# EAGLE design daGloane1.1 (EAGLE 6.1)
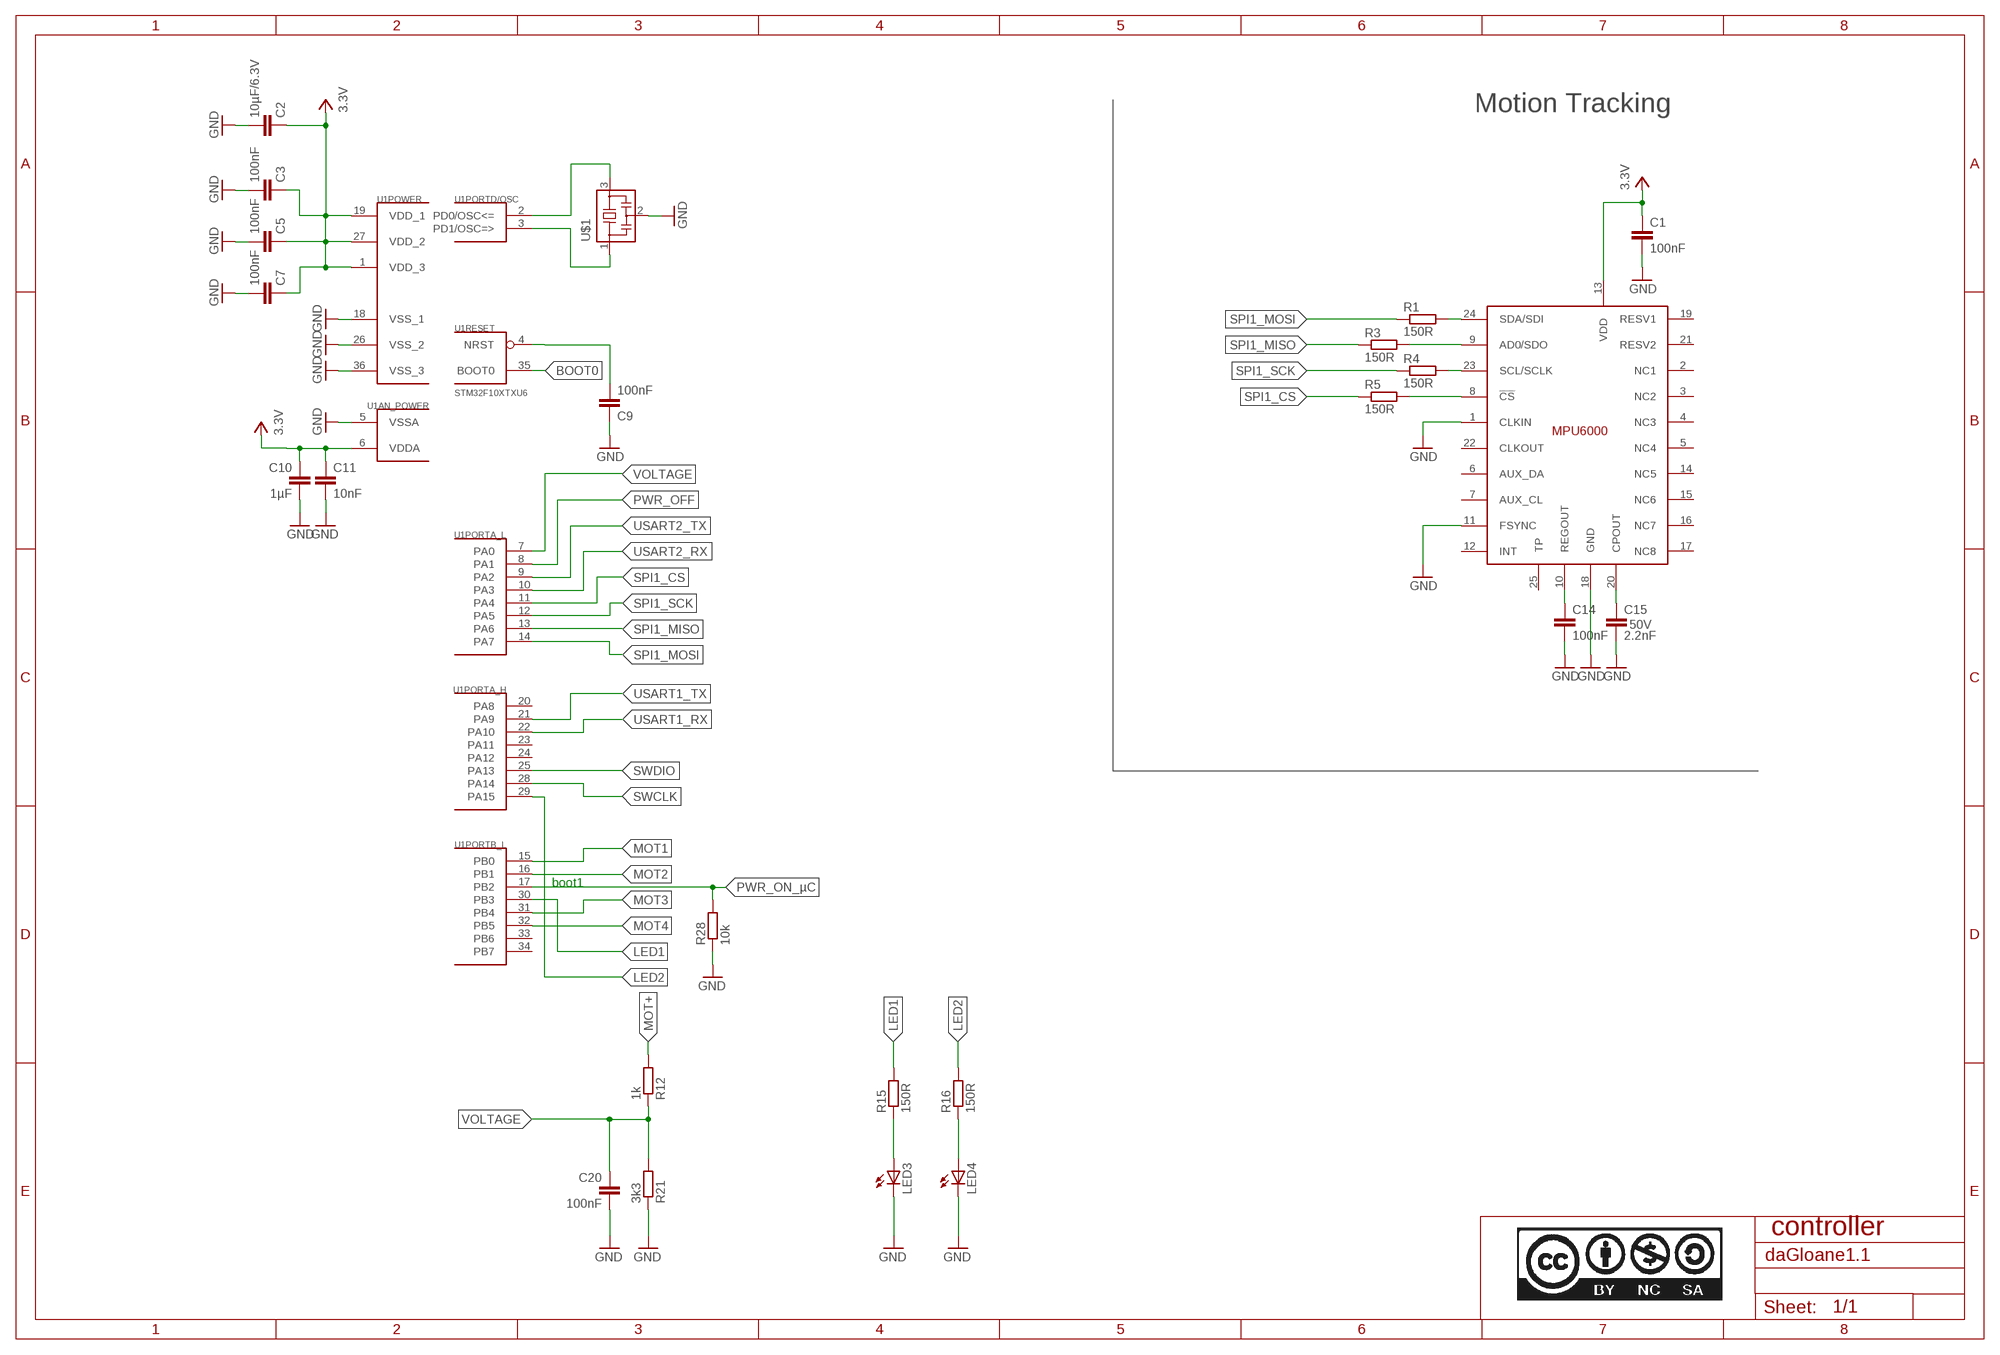
[diagram p0: schematic, sheet 1, part 1 of 3]
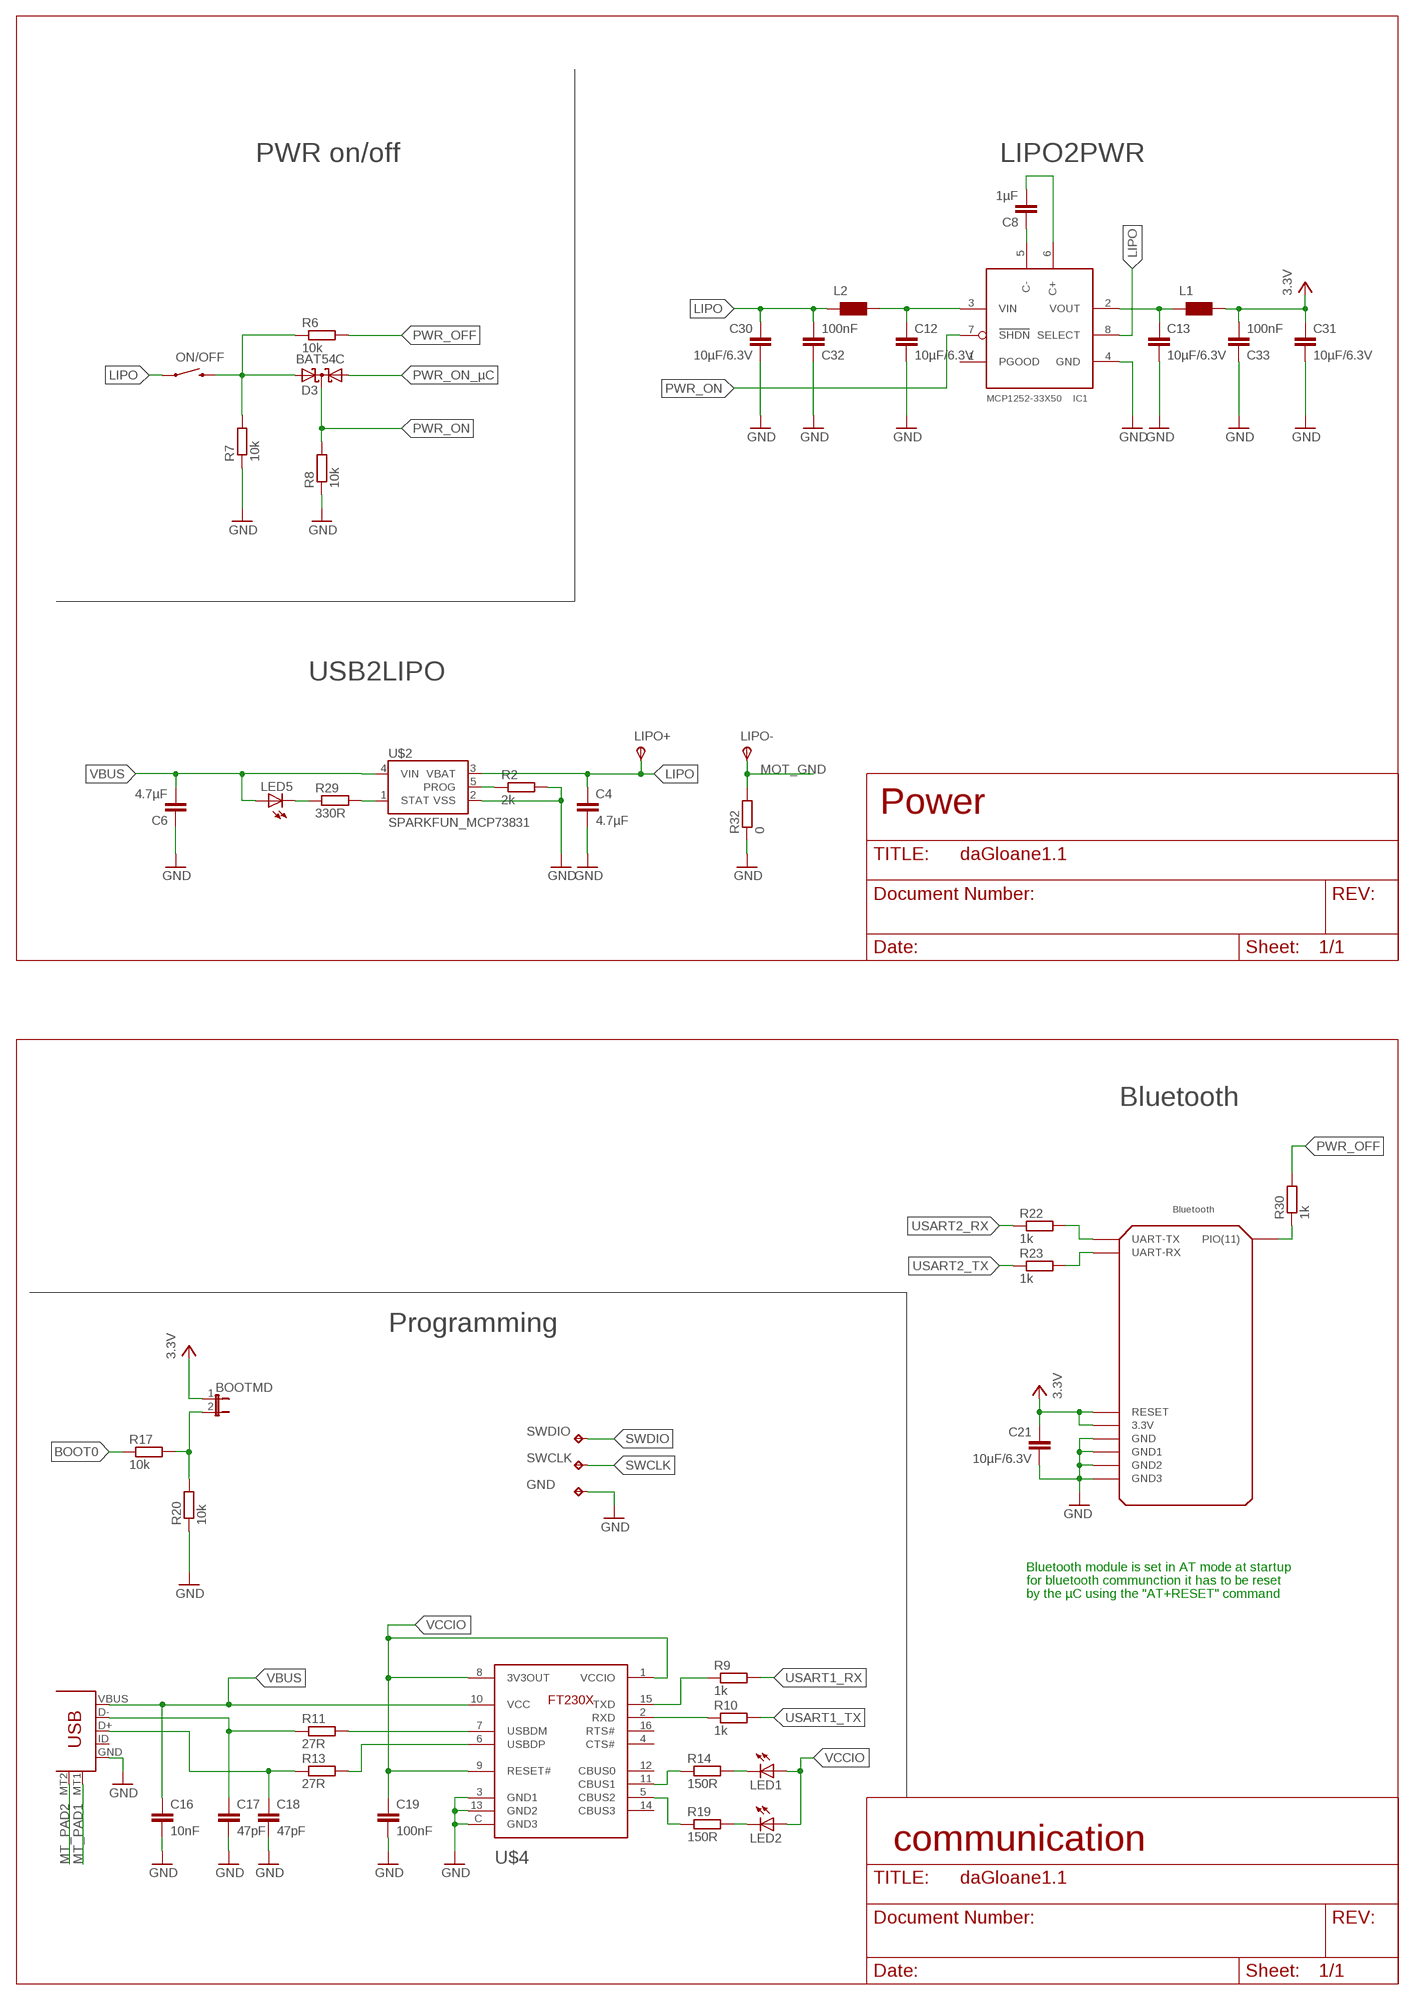
[diagram p1: schematic, sheet 1, part 2 of 3]
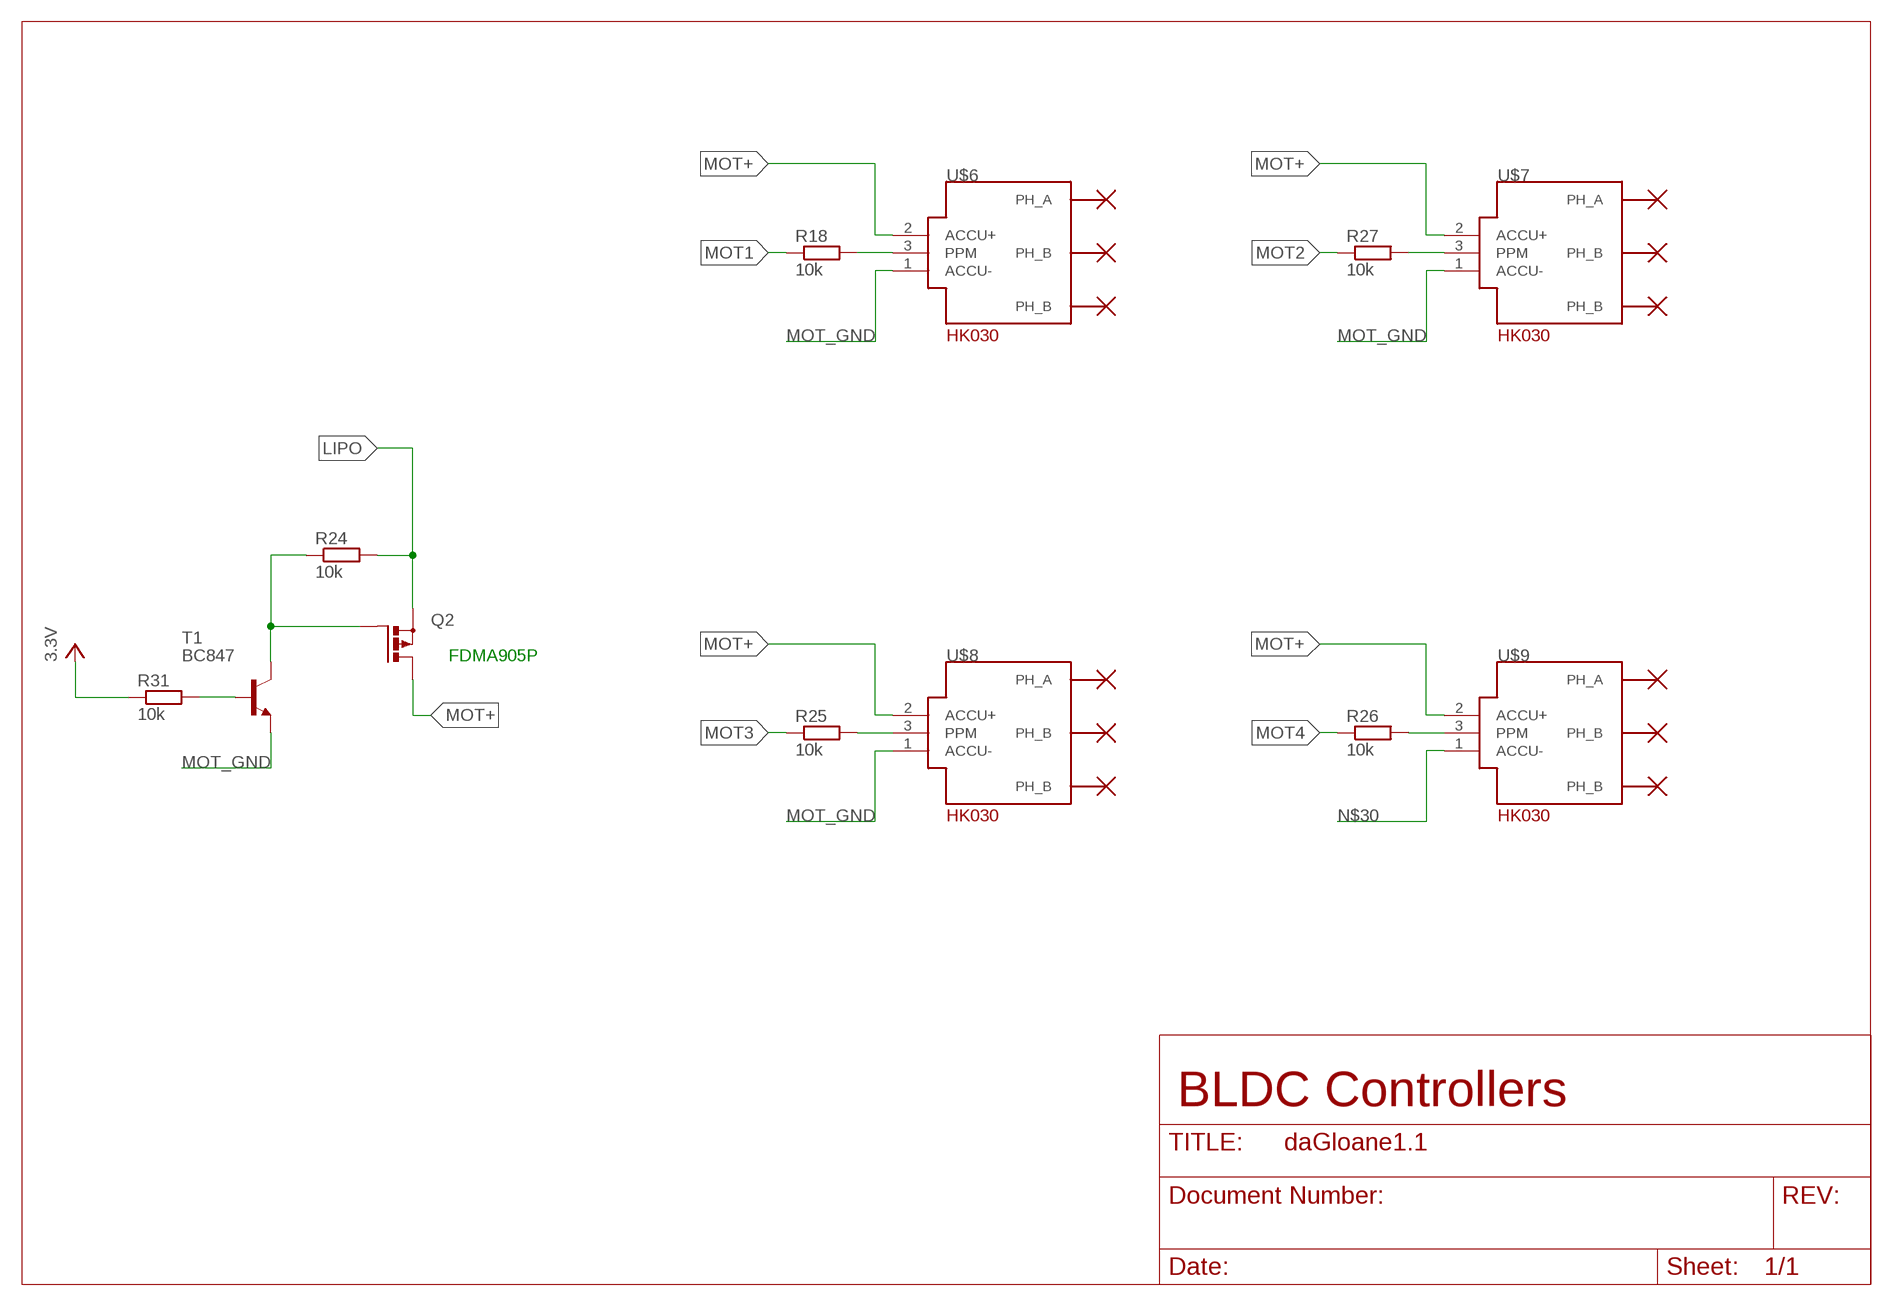
[diagram p2: schematic, sheet 1, part 3 of 3]

## Parts
BOOTMD  JUMPER-2  [1X02_50MIL]
C1  100nF  C-EUC0603  [C0603]
C2  10µF/6.3V  C-EUC0805  [C0805]
C3  100nF  C-EUC0603  [C0603]
C4  4.7µF  C-EUC0603  [C0603]
C5  100nF  C-EUC0603  [C0603]
C6  4.7µF  C-EUC0603  [C0603]
C7  100nF  C-EUC0603  [C0603]
C8  1µF  C-EUC0603  [C0603]
C9  100nF  C-EUC0603  [C0603]
C10  1µF  C-EUC0603  [C0603]
C11  10nF  C-EUC0603  [C0603]
C12  10µF/6.3V  C-EUC0805  [C0805]
C13  10µF/6.3V  C-EUC0805  [C0805]
C14  100nF  C-EUC0603  [C0603]
C15  2.2nF  C-EUC0603  [C0603]
C16  10nF  C-EUC0603  [C0603]
C17  47pF  C-EUC0603  [C0603]
C18  47pF  C-EUC0603  [C0603]
C19  100nF  C-EUC0603  [C0603]
C20  100nF  C-EUC0603  [C0603]
C21  10µF/6.3V  C-EUC0805  [C0805]
C30  10µF/6.3V  C-EUC0805  [C0805]
C31  10µF/6.3V  C-EUC0805  [C0805]
C32  100nF  C-EUC0603  [C0603]
C33  100nF  C-EUC0603  [C0603]
D3  BAT54C  [SOT23]
GND  TESTPAD_TPB1,27  [TESTPAD_B1,27]
IC1  MCP1252-33X50  [MSOP8]
L1  WUERTH-ELEKTRONIK_WE-KI_0805_B  [WUERTH-ELEKTRONIK_WE-KI_0805_B]
L2  WUERTH-ELEKTRONIK_WE-KI_0805_B  [WUERTH-ELEKTRONIK_WE-KI_0805_B]
LED1  LEDCHIPLED_0603  [CHIPLED_0603]
LED2  LEDCHIPLED_0603  [CHIPLED_0603]
LED3  LEDCHIPLED_0603  [CHIPLED_0603]
LED4  LEDCHIPLED_0603  [CHIPLED_0603]
LED5  LEDCHIPLED_0603  [CHIPLED_0603]
LIPO+  TPSPAD1-13  [P1-13]
LIPO-  TPSPAD1-13  [P1-13]
ON/OFF  SWITCH-MOMENTARY-2SMD  [TACTILE_SWITCH_SMD]
Q2  P-MOSFET-SO8  [MICROFET2X2]
R1  150R  R-EU_R0603  [R0603]
R2  2k  R-EU_R0603  [R0603]
R3  150R  R-EU_R0603  [R0603]
R4  150R  R-EU_R0603  [R0603]
R5  150R  R-EU_R0603  [R0603]
R6  10k  R-EU_R0603  [R0603]
R7  10k  R-EU_R0603  [R0603]
R8  10k  R-EU_R0603  [R0603]
R9  1k  R-EU_R0603  [R0603]
R10  1k  R-EU_R0603  [R0603]
R11  27R  R-EU_R0603  [R0603]
R12  1k  R-EU_R0603  [R0603]
R13  27R  R-EU_R0603  [R0603]
R14  150R  R-EU_R0603  [R0603]
R15  150R  R-EU_R0603  [R0603]
R16  150R  R-EU_R0603  [R0603]
R17  10k  R-EU_R0603  [R0603]
R18  10k  R-EU_R0603  [R0603]
R19  150R  R-EU_R0603  [R0603]
R20  10k  R-EU_R0603  [R0603]
R21  3k3  R-EU_R0603  [R0603]
R22  1k  R-EU_R0603  [R0603]
R23  1k  R-EU_R0603  [R0603]
R24  10k  R-EU_R0603  [R0603]
R25  10k  R-EU_R0603  [R0603]
R26  10k  R-EU_R0603  [R0603]
R27  10k  R-EU_R0603  [R0603]
R28  10k  R-EU_R0603  [R0603]
R29  330R  R-EU_R0603  [R0603]
R30  1k  R-EU_R0603  [R0603]
R31  10k  R-EU_R0603  [R0603]
R32  0  R-EU_R0603  [R0603]
SWCLK  TESTPAD_TPB1,27  [TESTPAD_B1,27]
SWDIO  TESTPAD_TPB1,27  [TESTPAD_B1,27]
T1  BC847  [SOT23]
U1  STM32F10XTXU6  [VFQFPN36]
U$1  MURATA-FILTER_CSTCE__G  [MURATA-FILTER_CSTCE__G]
U$2  SPARKFUN_MCP73831  [SPARKFUN_SOT23-5]
U$3  MPU6000  [MPU6000]
U$4  SERIAL_FT230XQ  [SERIAL_QFN4X4-16]
U$5  BLUETOOTH_REDUCED  [BLUETOOTH_REDUCED]
U$6  3A_BLDC_CONTROLLER  [3A_BLDC_CONTROLLER]
U$7  3A_BLDC_CONTROLLER  [3A_BLDC_CONTROLLER]
U$8  3A_BLDC_CONTROLLER  [3A_BLDC_CONTROLLER]
U$9  3A_BLDC_CONTROLLER  [3A_BLDC_CONTROLLER]
X2  USB_MICROB_PLUG_MT  [SPARKFUN-CONNECTORS_USB-MICROB]

## Nets
BOOT0: R17.1 U1.35(RESET:BOOT0)
D+: C18.1 R13.1 X2.D+
D-: C17.1 R11.1 X2.D-
GND: C1.2 C2.2 C3.2 C4.2 C5.2 C6.1 C7.2 C9.1 C10.2 C11.2 C12.2 C13.2 C14.2 C15.2 C16.2 C17.2 C18.2 C19.2 C20.2 C21.2 C30.2 C31.2 C32.1 C33.1 GND.PP(TP) IC1.4(GND) LED3.C LED4.C R2.2 R7.1 R8.1 R20.1 R21.1 R28.1 R32.1 U1.5(AN_POWER:VSSA) U1.18(POWER:VSS_1) U1.26(POWER:VSS_2) U1.36(POWER:VSS_3) U$1.2 U$2.2(VSS) U$3.1(CLKIN) U$3.11(FSYNC) U$3.18(GND) U$4.3(GND1) U$4.13(GND2) U$4.C(GND3) U$5.P$13(GND) U$5.P$14(GND1) U$5.P$21(GND2) U$5.P$22(GND3) X2.GND
LED1: R15.2 U1.30(PORTB_L:PB3)
LED2: R16.2 U1.29(PORTA_H:PA15)
LIPO: C4.1 C30.1 C32.2 IC1.8(SELECT) L2.2 LIPO+.TP(PP) ON/OFF.1 Q2.P$4(S) Q2.P$7(S) R24.2 U$2.3(VBAT)
MOT1: R18.1 U1.15(PORTB_L:PB0)
MOT2: R27.1 U1.16(PORTB_L:PB1)
MOT3: R25.1 U1.31(PORTB_L:PB4)
MOT4: R26.1 U1.32(PORTB_L:PB5)
MOT+: Q2.P$1(D) Q2.P$2(D) Q2.P$5(D) Q2.P$6(D) Q2.P$8(D) R12.2 U$6.2(ACCU+) U$7.2(ACCU+) U$8.2(ACCU+) U$9.2(ACCU+)
MOT_GND: LIPO-.TP(PP) R32.2 T1.2(E) U$6.1(ACCU-) U$7.1(ACCU-) U$8.1(ACCU-)
MT_PAD1: X2.MT1(MTN1)
MT_PAD2: X2.MT2(MTN2)
N$1: LED2.C R19.2
N$2: U1.2(PORTD/OSC:PD0/OSC<=) U$1.3
N$3: R2.1 U$2.5(PROG)
N$4: R5.2 U$3.8(!CS)
N$5: C15.1 U$3.20(CPOUT)
N$6: C14.1 U$3.10(REGOUT)
N$7: R22.2 U$5.P$1(UART-TX)
N$8: LED3.A R15.1
N$9: LED4.A R16.1
N$10: BOOTMD.2 R17.2 R20.2
N$11: R14.1 U$4.11(CBUS1)
N$12: R19.1 U$4.5(CBUS2)
N$13: R4.2 U$3.23(SCL/SCLK)
N$14: LED1.C R14.2
N$15: R23.2 U$5.P$2(UART-RX)
N$16: R11.2 U$4.7(USBDM)
N$17: R13.2 U$4.6(USBDP)
N$18: R3.2 U$3.9(AD0/SDO)
N$19: R1.2 U$3.24(SDA/SDI)
N$20: R9.1 U$4.15(TXD)
N$21: R10.1 U$4.2(RXD)
N$22: R18.2 U$6.3(PPM)
N$23: D3.2(A2) ON/OFF.3 R6.1 R7.2
N$24: C8.2 IC1.6(C+)
N$25: U1.3(PORTD/OSC:PD1/OSC=>) U$1.1
N$26: R30.1 U$5.P$34(PIO(11))
N$27: Q2.P$3(G) R24.1 T1.3(C)
N$28: C8.1 IC1.5(C-)
N$29: R31.2 T1.1(B)
N$30: U$9.1(ACCU-)
N$39: R27.2 U$7.3(PPM)
N$40: R25.2 U$8.3(PPM)
N$41: R26.2 U$9.3(PPM)
N$43: R29.2 U$2.1(STAT)
N$44: LED5.C R29.1
N$45: C12.1 IC1.3(VIN) L2.1
N$46: C13.1 IC1.2(VOUT) L1.2
PWR_OFF: R6.2 R30.2 U1.8(PORTA_L:PA1)
PWR_ON: D3.3(CC) IC1.7(SHDN) R8.2
PWR_ON_µC: D3.1(A1) R28.2 U1.17(PORTB_L:PB2)
RESET1: C9.2 U1.4(RESET:NRST)
SPI1_CS: R5.1 U1.11(PORTA_L:PA4)
SPI1_MISO: R3.1 U1.13(PORTA_L:PA6)
SPI1_MOSI: R1.1 U1.14(PORTA_L:PA7)
SPI1_SCK: R4.1 U1.12(PORTA_L:PA5)
SWCLK: SWCLK.PP(TP) U1.28(PORTA_H:PA14)
SWDIO: SWDIO.PP(TP) U1.25(PORTA_H:PA13)
USART1_RX: R9.2 U1.22(PORTA_H:PA10)
USART1_TX: R10.2 U1.21(PORTA_H:PA9)
USART2_RX: R22.1 U1.10(PORTA_L:PA3)
USART2_TX: R23.1 U1.9(PORTA_L:PA2)
VBUS: C6.2 C16.1 LED5.A U$2.4(VIN) U$4.10(VCC) X2.VBUS
VCC: BOOTMD.1 C1.1 C2.1 C3.1 C5.1 C7.1 C10.1 C11.1 C21.1 C31.1 C33.2 L1.1 R31.1 U1.1(POWER:VDD_3) U1.6(AN_POWER:VDDA) U1.19(POWER:VDD_1) U1.27(POWER:VDD_2) U$3.13(VDD) U$5.P$11(RESET) U$5.P$12(3.3V) ; supply symbol labelled 3.3V
VCCIO: C19.1 LED1.A LED2.A U$4.1(VCCIO) U$4.8(3V3OUT) U$4.9(RESET#)
VOLTAGE: C20.1 R12.1 R21.2 U1.7(PORTA_L:PA0)
Unconnected: IC1.1(PGOOD) U1.20(PORTA_H:PA8) U1.23(PORTA_H:PA11) U1.24(PORTA_H:PA12) U1.33(PORTB_L:PB6) U1.34(PORTB_L:PB7) U$3.2(NC1) U$3.3(NC2) U$3.4(NC3) U$3.5(NC4) U$3.6(AUX_DA) U$3.7(AUX_CL) U$3.12(INT) U$3.14(NC5) U$3.15(NC6) U$3.16(NC7) U$3.17(NC8) U$3.19(RESV1) U$3.21(RESV2) U$3.22(CLKOUT) U$3.25(TP) U$4.4(CTS#) U$4.12(CBUS0) U$4.14(CBUS3) U$4.16(RTS#) X2.ID

## Notes on the sheet
- Motion Tracking
- boot1
- controller
- PWR on/off | LIPO2PWR
- FDMA905P
- USB2LIPO
- Power
- BLDC Controllers
- Bluetooth
- Programming
- Bluetooth module is set in AT mode at startup
- for bluetooth communction it has to be reset
- by the µC using the "AT+RESET" command
- FT230X
- communication

## Library data of the parts
BOOTMD = daGloane:JUMPER-2: Jumper Basic 0.1" spaced jumper. Use with breakaway headers.
C1-C14 C16-C21 C30-C33 = rcl:C-EU: CAPACITOR, European symbol
C15 = rcl:C-EU: CAPACITOR, European symbol; VOLTAGE: 50V
D3 = diode:BAT54C: Schottky Diodes Source: Fairchild .. BAT54.pdf
GND SWCLK SWDIO = daGloane:TESTPAD_TP: Test pad
IC1 = daGloane:MCP1252-33X50: 650KHz 3.3V / 5.0V Selectable Switching Regulator
L1 L2 = daGloane:WUERTH-ELEKTRONIK_WE-KI: SMD Wire Wound Ceramic Inductor WE-KI - Wire wound - High thermal stability - Rated current up to 1 A - High Q-factor - High SRF -- Especially developed for high frequency applications -- Perfect for applications in telecommunications -- Bluetooth -- Wireless LAN
LED1-LED5 = led:LED: LED OSRAM: - CHIPLED LG R971, LG N971, LY N971, LG Q971, LY Q971, LO R971, LY R971 LH N974, LH R974 LS Q976, LO Q976, LY Q976 LO Q996 - Hyper CHIPLED LW Q18S LB Q993, LB Q99A, LB R99A - SideLED LS A670, LO A670, LY A670, LG A670, LP A670 LB A673, LV A673, LT A673, LW A673 LH A674 LY A675 LS A676, LA A676, LO A676, LY A676, LW A676 LS A679, LY A679, LG A679 - Hyper Micro SIDELED® LS Y876, LA Y876, LO Y876, LY Y876 LT Y87S - SmartLED LW L88C, LW L88S LB L89C, LB L89S, LG L890 LS L89K, LO L89K, LY L89K LS L896, LA L896, LO L896, LY L896 - TOPLED LS T670, LO T670, LY T670, LG T670, LP T670 LSG T670, LSP T670, LSY T670, LOP T670, LYG T670 LG T671, LOG T671, LSG T671 LB T673, LV T673, LT T673, LW T673 LH T674 LS T676, LA T676, LO T676, LY T676, LB T676, LH T676, LSB T676, LW T676 LB T67C, LV T67C, LT T67C, LS T67K, LO T67K, LY T67K, LW E67C LS E67B, LA E67B, LO E67B, LY E67B, LB E67C, LV E67C, LT E67C LW T67C LS T679, LY T679, LG T679 LS T770, LO T770, LY T770, LG T770, LP T770 LB T773, LV T773, LT T773, LW T773 LH T774 LS E675, LA E675, LY E675, LS T675 LS T776, LA T776, LO T776, LY T776, LB T776 LHGB T686 LT T68C, LB T68C - Hyper Mini TOPLED® LB M676 - Mini TOPLED Santana® LG M470 LS M47K, LO M47K, LY M47K Source: http://www.osram.convergy.de LUXEON: - LUMILED® LXK2-PW12-R00, LXK2-PW12-S00, LXK2-PW14-U00, LXK2-PW14-V00 LXK2-PM12-R00, LXK2-PM12-S00, LXK2-PM14-U00 LXK2-PE12-Q00, LXK2-PE12-R00, LXK2-PE12-S00, LXK2-PE14-T00, LXK2-PE14-U00 LXK2-PB12-K00, LXK2-PB12-L00, LXK2-PB12-M00, LXK2-PB14-N00, LXK2-PB14-P00, LXK2-PB14-Q00 LXK2-PR12-L00, LXK2-PR12-M00, LXK2-PR14-Q00, LXK2-PR14-R00 LXK2-PD12-Q00, LXK2-PD12-R00, LXK2-PD12-S00 LXK2-PH12-R00, LXK2-PH12-S00 LXK2-PL12-P00, LXK2-PL12-Q00, LXK2-PL12-R00 Source: www.luxeon.com KINGBRIGHT: KA-3528ASYC Source: www.kingbright.com
LIPO+ LIPO- = testpad:TPS: TEST PIN
ON/OFF = daGloane:SWITCH-MOMENTARY-2: Various NO switches- pushbuttons, reed, etc
Q2 = daGloane:P-MOSFET-SO8: P-Channel MOSFET Example: FDS4435A; P-Channel Logic Level PowerTrench® MOSFET FDS4465; P-Channel 1.8V Specified PowerTrench® MOSFET Source: www.fairchildsemi.com
R1-R32 = rcl:R-EU_: RESISTOR, European symbol
T1 = transistor:BC847: NPN TRANSISTOR
U1 = daGloane:STM32F10XTXU6: STM32F101/103 36pad VFQPFN36
U$1 = daGloane:MURATA-FILTER_CSTCE__G
U$2 = daGloane:SPARKFUN_MCP73831: Microchip s MCP73831 Miniature single cell, fully integrated Li-Ion, Li-polymer charge management controller http://ww1.microchip.com/downloads/en/DeviceDoc/21984a.pdf'
U$3 = daGloane:MPU6000
U$4 = daGloane:SERIAL_FT230XQ
U$5 = daGloane:BLUETOOTH_REDUCED
U$6-U$9 = daGloane:3A_BLDC_CONTROLLER
X2 = daGloane:USB_MICROB_PLUG_MT

## Board
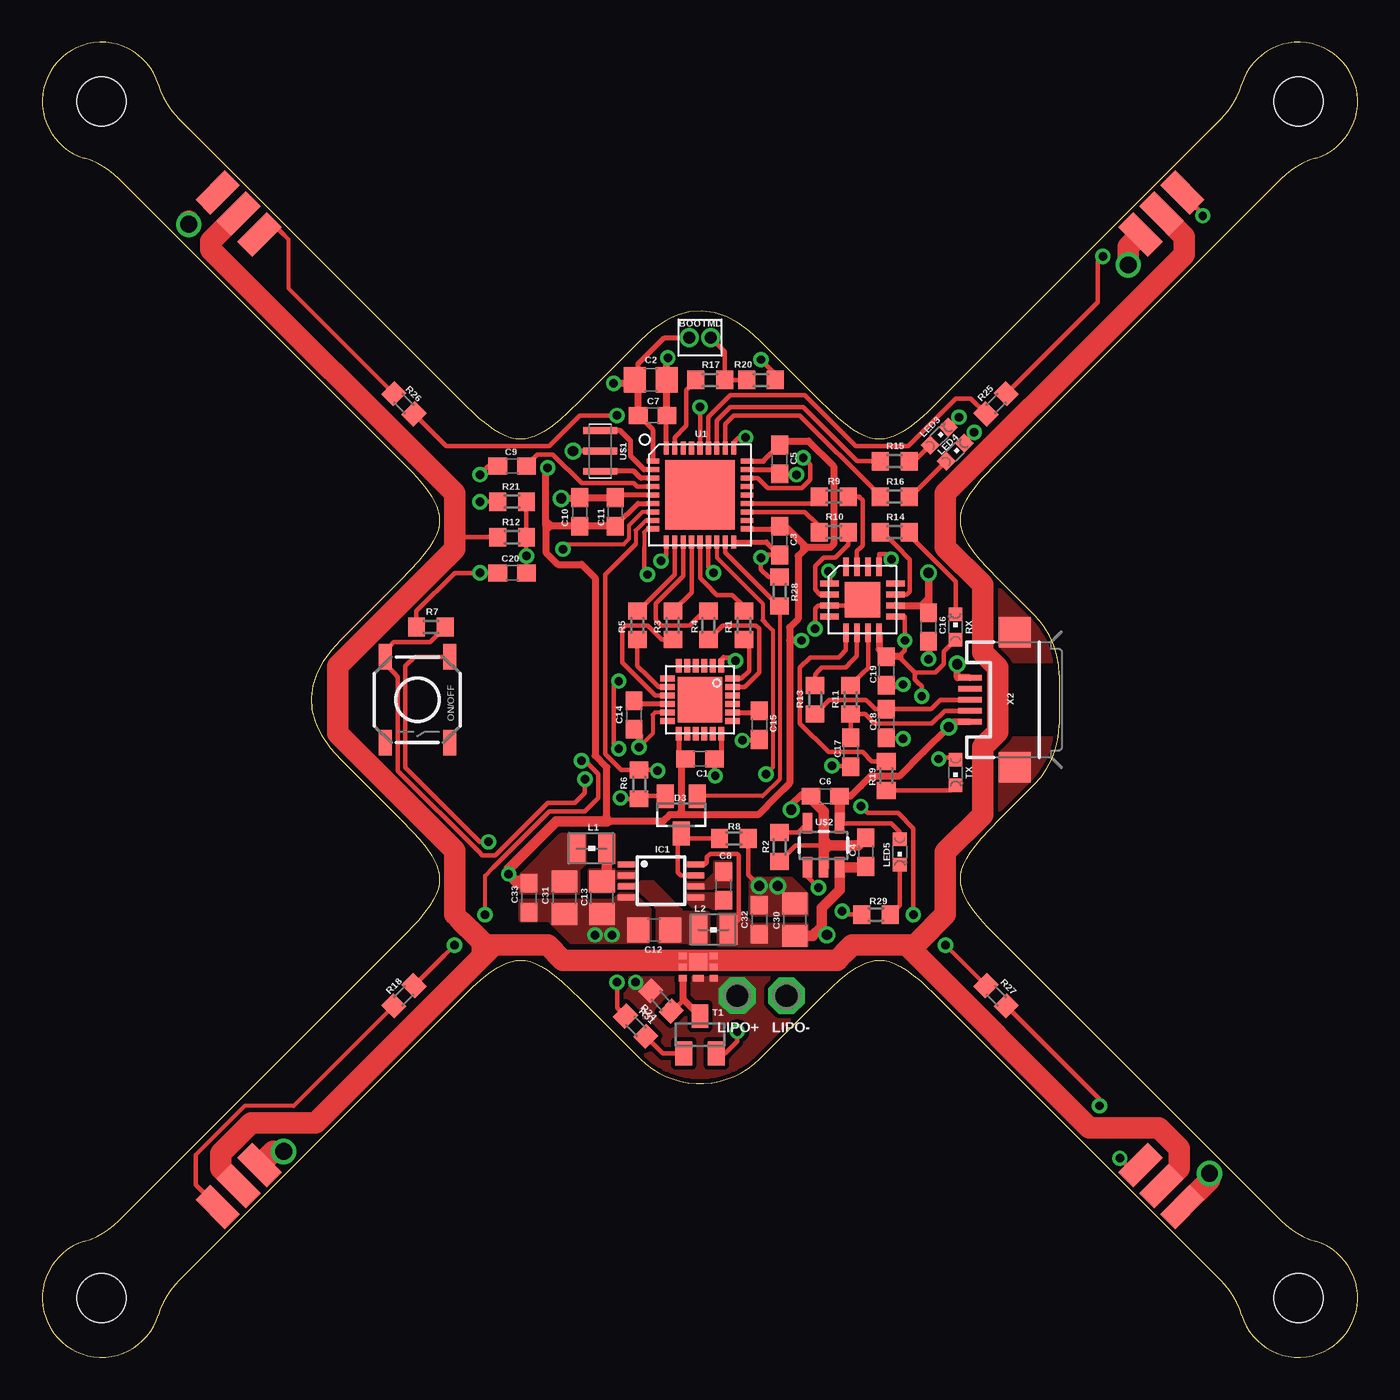
[diagram p3: board, top side]
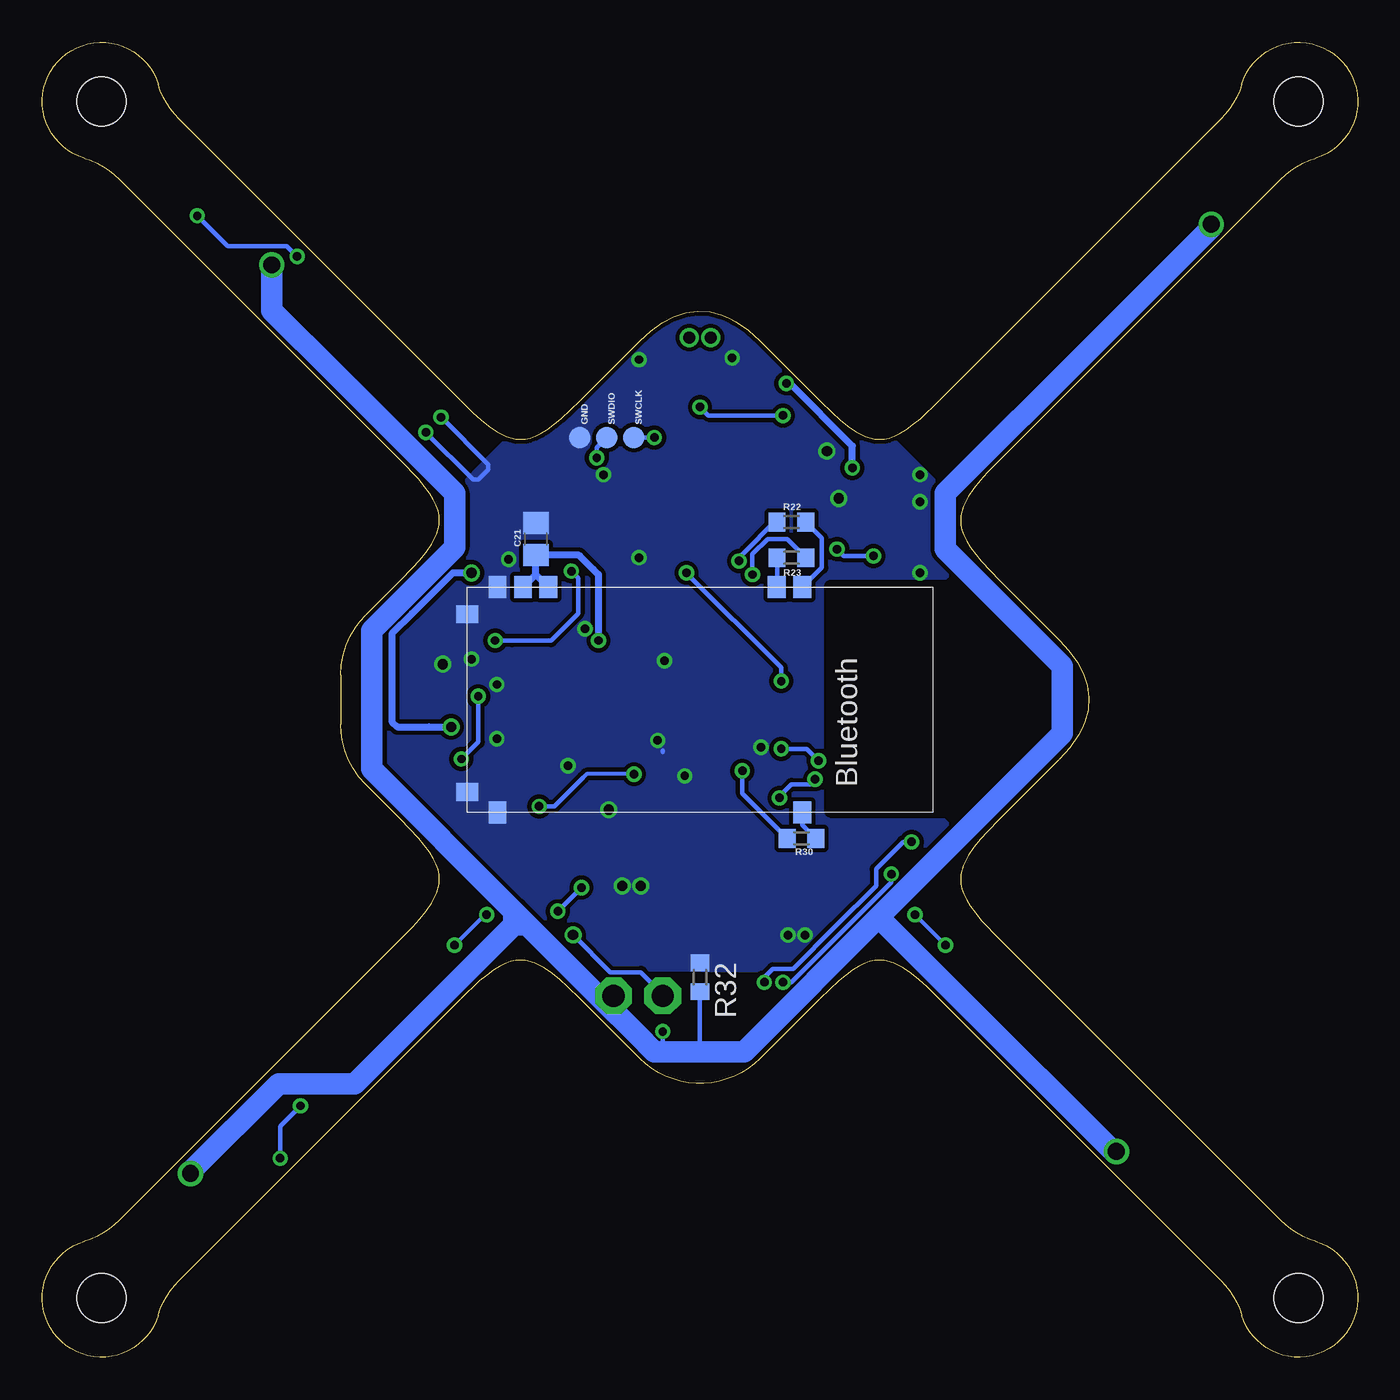
[diagram p4: board, bottom side, seen from below]

Size 77.71 x 77.71 mm. Coordinates in mm from the lower left corner, seen from the top.
Outline: 2.48,6.85 arc236 6.85,2.48
Outline: 6.85,2.48 arc-29 8.09,4.56 24.71,21.18 25.44,21.88 25.9,22.29 26.37,22.67 26.84,23 27.43,23.3 27.98,23.45 28.53,23.45 28.83,23.39 29.13,23.28 29.48,23.1 29.82,22.89 30.25,22.57 30.67,22.22 31.78,21.18 35.32,17.64 arc90 42.39,17.64 45.92,21.18 46.65,21.88 47.11,22.29 47.58,22.67 48.06,23 48.64,23.3 49.19,23.45 49.74,23.45 50.04,23.39 50.34,23.28 50.69,23.1 51.03,22.89 51.46,22.57 51.88,22.22 53,21.18 69.61,4.56 arc-29 70.86,2.48 arc236 75.23,6.85 arc-29 73.15,8.09 56.53,24.71 55.83,25.44 55.42,25.9 55.04,26.37 54.71,26.84 54.4,27.43 54.25,27.98 54.25,28.53 54.32,28.83 54.43,29.13 54.6,29.48 54.82,29.82 55.13,30.25 55.48,30.67 56.53,31.78 58.6,33.85 59,34.3 59.34,34.78 59.63,35.31 59.85,35.87 59.99,36.46 60.05,36.92 60.07,37.39 60.07,40.32 60.03,40.92 59.94,41.5 59.76,42.08 59.52,42.63 59.2,43.14 58.92,43.51 58.6,43.85 56.53,45.92 55.83,46.65 55.42,47.11 55.04,47.58 54.71,48.06 54.4,48.64 54.25,49.19 54.25,49.74 54.32,50.04 54.43,50.34 54.6,50.69 54.82,51.03 55.13,51.46 55.48,51.88 56.53,53 73.15,69.61 arc-29 75.23,70.86
Outline: 2.48,6.85 arc29 4.56,8.09 21.18,24.71 22.22,25.82 22.57,26.25 22.89,26.67 23.1,27.02 23.28,27.37 23.39,27.66 23.45,27.96 23.45,28.52 23.3,29.07 23,29.65 22.67,30.12 22.29,30.59 21.88,31.05 21.18,31.78 17.64,35.32 17.02,36 16.5,36.74 16.29,37.13 16.12,37.53 15.93,38.24 15.87,38.98 15.97,39.7 16.21,40.41 16.57,41.08 17.07,41.76 17.64,42.39 21.18,45.92 22.22,47.04 22.57,47.46 22.89,47.89 23.1,48.23 23.28,48.58 23.39,48.88 23.45,49.18 23.45,49.73 23.3,50.28 23,50.86 22.67,51.34 22.29,51.81 21.88,52.27 21.18,53 4.56,69.61 arc29 2.48,70.86 arc-236 6.85,75.23 arc29 8.09,73.15 24.71,56.53 25.82,55.48 26.25,55.13 26.67,54.82 27.02,54.6 27.37,54.43 27.66,54.32 27.96,54.25 28.52,54.25 29.07,54.4 29.65,54.71 30.12,55.04 30.59,55.42 31.05,55.83 31.78,56.53 35.32,60.07 36,60.68 36.74,61.2 37.13,61.41 37.53,61.59 38.24,61.78 38.98,61.83 39.7,61.73 40.41,61.49 41.08,61.13 41.76,60.64 42.39,60.07 45.92,56.53 47.04,55.48 47.46,55.13 47.89,54.82 48.23,54.6 48.58,54.43 48.88,54.32 49.18,54.25 49.73,54.25 50.28,54.4 50.86,54.71 51.34,55.04 51.81,55.42 52.27,55.83 53,56.53 69.61,73.15 arc29 70.86,75.23
Outline: 75.23,70.86 arc236 70.86,75.23
Copper layers (1*16): Top 0.035mm / dielectric 1.5mm / Bottom 0.035mm
Design rules: minimum track width 0.15mm, minimum drill 0.3mm, track to track 0.15mm, track to pad 0.15mm, pad to pad 0.15mm, via to via 0.15mm, smd to smd 0mil, copper to edge 0.2mm, drill to drill 0.2mm, minimum pad ring 0.2mm, minimum via ring 0.2mm, stop-mask expansion 4mil, vias tented up to drill 0.8mm, thermal gap 0.15mm
Holes 2.9 mm at 3.5,3.5 74.21,3.5 74.21,74.21 3.5,74.21
bRestrict: area 24.2,32.3 to 31.2,45.6

### Footprints (pad centres in the part's own frame; a part is rotated, then mirrored left to right if it is on the bottom)
1X02_50MIL = drill 0.7 pad 1.1: 1 -0.635,0; 2 0.635,0
C0603 = smd 1.1 x 1: 1 -0.85,0; 2 0.85,0
C0805 = smd 1.3 x 1.5: 1 -0.95,0; 2 0.95,0
SOT23 = smd 1 x 1.4: 1 -0.95,-1.1; 2 0.95,-1.1; 3 0,1.1
TESTPAD_B1,27 = smd 1.27 x 1.27: PP 0,0
MSOP8 = smd 0.35 x 1: 1 -0.975,-2.05; 2 -0.325,-2.05; 3 0.325,-2.05; 4 0.975,-2.05; 5 0.975,2.05; 6 0.325,2.05; 7 -0.325,2.05; 8 -0.975,2.05
WUERTH-ELEKTRONIK_WE-KI_0805_B = smd 1.02 x 1.78: 1 -0.89,0; 2 0.89,0
CHIPLED_0603 = smd 0.8 x 0.8: A 0,-0.75; C 0,0.75
P1-13 = drill 1.321 pad 2.159 octagon: TP 0,0
TACTILE_SWITCH_SMD = smd 1.524 x 0.762: 1 -2.54,1.905; 2 2.54,1.905; 3 -2.54,-1.905; 4 2.54,-1.905
MICROFET2X2 = smd 0.4 x 0.475: P$1 -0.65,-0.912; P$2 0,-0.912; P$3 0.65,-0.912; P$4 0.65,0.912; P$5 0,0.912; P$6 -0.65,0.912 | smd 0.4 x 0.66: P$7 0.65,0 | smd 1 x 1.05: P$8 -0.3,0
R0603 = smd 1 x 1.1: 1 -0.85,0; 2 0.85,0
VFQFPN36 = smd 0.75 x 0.3: 1 -2.775,2; 2 -2.775,1.5; 3 -2.775,1; 4 -2.775,0.5; 5 -2.775,0; 6 -2.775,-0.5; 7 -2.775,-1; 8 -2.775,-1.5; 9 -2.775,-2; 19 2.775,-2; 20 2.775,-1.5; 21 2.775,-1; 22 2.775,-0.5; 23 2.775,0; 24 2.775,0.5; 25 2.775,1; 26 2.775,1.5; 27 2.775,2 | smd 0.3 x 0.75: 10 -2,-2.775; 11 -1.5,-2.775; 12 -1,-2.775; 13 -0.5,-2.775; 14 0,-2.775; 15 0.5,-2.775; 16 1,-2.775; 17 1.5,-2.775; 18 2,-2.775; 28 2,2.775; 29 1.5,2.775; 30 1,2.775; 31 0.5,2.775; 32 0,2.775; 33 -0.5,2.775; 34 -1,2.775; 35 -1.5,2.775; 36 -2,2.775 | smd 4.1 x 4.1: TP 0,0
MURATA-FILTER_CSTCE__G = smd 0.4 x 2: 1 -1.2,0; 2 0,0; 3 1.2,0
SPARKFUN_SOT23-5 = smd 0.55 x 1.2: 1 -0.95,-1.3; 2 0,-1.3; 3 0.95,-1.3; 4 0.95,1.3; 5 -0.95,1.3
MPU6000 = smd 0.8 x 0.35: 1 -2,1.25; 2 -2,0.75; 3 -2,0.25; 4 -2,-0.25; 5 -2,-0.75; 6 -2,-1.25; 13 2,-1.25; 14 2,-0.75; 15 2,-0.25; 16 2,0.25; 17 2,0.75; 18 2,1.25 | smd 0.35 x 0.85: 7 -1.25,-1.925; 8 -0.75,-1.925; 9 -0.25,-1.925; 10 0.25,-1.925; 11 0.75,-1.925; 12 1.25,-1.925; 19 1.25,1.925; 20 0.75,1.925; 21 0.25,1.925; 22 -0.25,1.925; 23 -0.75,1.925; 24 -1.25,1.925 | smd 2.7 x 2.6: 25 0,0
SERIAL_QFN4X4-16 = smd 1.1 x 0.35: 1 -1.95,0.975; 2 -1.95,0.325; 3 -1.95,-0.325; 4 -1.95,-0.975; 9 1.95,-0.975; 10 1.95,-0.325; 11 1.95,0.325; 12 1.95,0.975 | smd 0.35 x 1.1: 5 -0.975,-1.95; 6 -0.325,-1.95; 7 0.325,-1.95; 8 0.975,-1.95; 13 0.975,1.95; 14 0.325,1.95; 15 -0.325,1.95; 16 -0.975,1.95 | smd 2.1 x 2.1: C 0,0
BLUETOOTH_REDUCED = smd 1.3 x 1.05: P$1 -6.65,6.04; P$2 -6.65,4.54; P$11 -6.65,-8.96; P$12 -6.65,-10.46; P$13 -6.65,-11.96; P$22 6.65,-11.96; P$34 6.65,6.04 | smd 1.05 x 1.3: P$14 -5.05,-13.75; P$21 5.45,-13.75
3A_BLDC_CONTROLLER = smd 2.45 x 1.25: 1 1.05,1.75; 2 1.05,0; 3 1.05,-1.75
SPARKFUN-CONNECTORS_USB-MICROB = smd 0.35 x 1.4: D+ 0,2.65; D- -0.65,2.65; GND 1.3,2.65; ID 0.65,2.65; VBUS -1.3,2.65 | smd 1.8 x 1.9: MT1 -4,0; MT2 4,0

### Placement (x,y rotation side)
BOOTMD  38.85,60.25 0 top
C1  38.85,35.35 0 top
C2  35.95,57.75 0 top
C3  43.55,48.25 270 top
C4  48.65,29.85 90 top
C5  43.55,53.05 270 top
C6  46.25,33.15 0 top
C7  36.05,55.65 0 top
C8  40.25,27.85 90 top
C9  27.75,52.65 0 top
C10  31.75,49.95 90 top
C11  33.85,49.95 90 top
C12  36.15,25.25 180 top
C13  33.05,27.15 270 top
C14  34.95,37.95 270 top
C15  42.35,37.35 270 top
C16  52.35,43.15 270 top
C17  47.75,35.75 270 top
C18  49.85,37.45 270 top
C19  49.85,40.55 270 top
C20  27.75,46.35 180 top
C21  48.55,48.35 90 bottom
C30  44.45,25.85 90 top
C31  30.85,27.15 270 top
C32  42.35,25.85 270 top
C33  28.75,27.15 90 top
D3  37.75,32.05 180 top
GND  45.95,54.35 0 bottom
IC1  36.55,28.15 270 top
L1  32.45,30.05 0 top
L2  39.65,25.25 0 top
LED1  53.95,43.15 0 top
LED2  53.95,34.55 180 top
LED3  52.98,54.42 315 top
LED4  53.92,53.48 315 top
LED5  50.65,29.85 180 top
LIPO+  41.05,21.35 180 top
LIPO-  43.95,21.35 180 top
ON/OFF  22.15,38.85 270 top
Q2  38.75,23.05 270 top
R1  41.45,43.25 270 top
R2  43.55,30.15 270 top
R3  37.25,43.25 270 top
R4  39.35,43.25 270 top
R5  35.15,43.25 270 top
R6  35.25,33.85 90 top
R7  22.95,43.15 0 top
R8  40.85,30.65 180 top
R9  46.75,50.85 180 top
R10  46.75,48.75 180 top
R11  47.75,38.85 90 top
R12  27.75,48.45 180 top
R13  45.65,38.85 90 top
R14  50.35,48.75 0 top
R15  50.35,52.95 180 top
R16  50.35,50.85 180 top
R17  39.45,57.75 0 top
R18  21.35,21.35 225 top
R19  49.85,34.35 270 top
R20  42.45,57.75 180 top
R21  27.75,50.55 0 top
R22  33.45,49.35 0 bottom
R23  33.45,47.25 180 bottom
R24  36.55,21.05 135 top
R25  56.35,56.35 45 top
R26  21.35,56.35 135 top
R27  56.35,21.35 315 top
R28  43.55,45.25 270 top
R29  49.25,26.15 180 top
R30  32.85,30.65 180 bottom
R31  35.05,19.55 315 top
R32  38.85,22.45 270 bottom
SWCLK  42.75,54.35 0 bottom
SWDIO  44.35,54.35 0 bottom
T1  38.85,19.05 0 top
U1  38.85,50.95 0 top
U$1  32.95,53.55 90 top
U$2  46.15,30.25 0 top
U$3  38.85,38.85 270 top
U$4  48.45,44.75 0 top
U$5  38.85,38.85 270 bottom
U$6  10.85,10.85 315 top
U$7  66.85,10.85 225 top
U$8  66.85,66.85 135 top
U$9  10.85,66.85 45 top
U$11  [DAGLOANE_LOGO]  28.85,38.85 90 top
X2  57.45,38.85 90 top

### Tracks (layer width: path | path; a pad name or v marks a point on that pad's centre or on a via)
BOOT0
  Top 0.254: U1.35 37.35,54.35 38.05,55.05 38.05,57.15 38.6,57.7 R17.1
D+
  Top 0.254: R13.1 46.5,38.85 48.55,38.85 48.65,38.85 48.85,38.65 49.2,38.3 C18.1 52.5,38.3 53.05,38.85 53.25,38.85 X2.D+
D-
  Top 0.254: C17.1 R11.1 48.6,38 48.75,37.85 49.15,37.45 49.75,37.45 52.55,37.45 53.3,38.2 X2.D-
GND  (via drill 0.5, 0.6)
  Top 0.25: U$3.11 36.2,38.1 36.05,37.95 36.05,36.85 v35.25,36.05
  Top 0.254: R20.1 43.3,58.1 v42.45,58.95 | v44.55,52.15 43.3,52.15 43.5,52.15 C5.2 43.3,52.45 | 48.03,44.43 U$4.3 45.83,44.43 45.65,44.25 v45.65,43.05 | LED3.C 53.55,54.95 v54.15,55.55 | LED4.C 54.45,54.05 v55.05,54.65 | U$4.13 49.43,47.45 49.85,47.45 v50.15,47.15 | 47.65,34.95 v46.65,34.95 | C9.1 26.35,52.65 v25.85,52.15 | R21.1 v25.85,50.55 | C20.2 v25.85,46.35 24.35,46.35 22.1,44.1 R7.1 | C15.2 42.3,36.45 | v42.45,47.25 42.45,46.55 42.9,46.1 R28.1 | 50,36.55 v50.85,36.55 | R8.1 41.7,28.5 v42.35,27.85 | R2.2 44.5,30.25 46.15,30.25
  Top 0.3: U1.26 43,52.45 43.3,52.45
  Top 0.305: U1.36 36.85,55.5 | U1.5 34,50.95 C11.2 | U$1.2 v31.35,53.55 | U1.18 42.78,48.18 C3.2 42.6,47.4 v42.45,47.25 | U$3.18 40.1,35.75 C1.2 39.7,34.4 v39.75,34.35 | C15.2 42,36.85 | U$3.1 40.1,41.2 40.25,41.35 40.75,41.35 v40.95,41.15 | 42.3,36.45 v41.35,36.45
  Top 0.406: C11.2 C10.2 31.7,50.75 v30.65,50.75 | v36.95,59.05 36.9,59 C2.2 C7.2 36.85,55.6 36.85,55.5 | v44.25,32.35 44.25,32.65 44.85,33.25 45.25,33.25 45.35,33.15 C6.1 45.5,33.05 45.5,32.9 | C14.2 35.25,36.8 v35.25,36.05 | C16.2 v52.35,41.25 | X2.GND 54.05,40.15 v54.05,40.95 | C19.2 50.8,39.7 v50.85,39.75 | 48.03,44.43 48.13,44.43 U$4.C | 47.65,34.95 47.7,34.95 C17.2 | C18.2 49.95,36.6 50,36.55
  Top 0.61: U$2.2 46.15,29.95 | 46.15,29.95 46.15,30.25 | 46.15,30.25 46.15,30.55 | 46.15,30.55 46.15,32.25 45.5,32.9 | 44.85,26.8 C30.2 | 46.15,30.25 46.45,30.25 | 46.45,30.25 48.2,30.25 C4.2 | 46.45,30.25 46.15,29.95 | 46.45,30.25 46.15,30.55
  Bottom 0.254: v44.55,52.15 44.35,52.15 | v54.15,55.55 51.35,52.75 51.35,52.45 51.95,51.85 52.25,51.85 v55.05,54.65 | 41.05,35.85 41.05,35.75 | R32.1 38.9,23.3 39.25,23.65
  Bottom 0.406: v36.95,59.05 36.95,59.15
  other vias: 33.65,24.95 32.65,24.95 43.45,27.85
  pour Top (no thermals): 34.15,27.35 34.85,27.35 35.85,26.45 35.85,24.65 35.75,24.55 31.25,24.55 29.95,25.85 28.25,25.85 28.25,26.95 33.75,26.95
  pour Bottom (isolate 0.254, no thermals): 21.85,48.6 25.25,45.2 25.25,32.5 21.85,29.1 27.85,22.85 49.65,22.9 65.6,38.85 38.85,65.6
  pour Top (no thermals): 41.85,28.05 41.85,26.25 41.95,26.15 45.15,26.15 45.15,27.35 44.25,28.25 42.05,28.25
LED1
  Top 0.254: U1.30 39.85,55.35 40.65,56.15 42.25,56.15 44.95,56.15 47.4,53.7 48.15,52.95 R15.2
LED2
  Top 0.254: U1.29 40.35,55.15 40.85,55.65 42.35,55.65 44.75,55.65 49.25,51.15 49.25,51.1 R16.2
LIPO  (via drill 0.5, 0.6)
  Top 0.254: IC1.8 39.13,29.13 39.25,29.25 39.25,29.55 39.45,29.75 41.05,29.75 41.15,29.65 41.15,25.86 L2.2 | 45.95,25.35 v46.35,24.95 | ON/OFF.1 21.99,41.39 21.45,40.85 21.45,34.85 25.85,30.45 v26.35,30.45
  Top 0.61: C4.1 48.6,28.95 U$2.3 47.1,27.6 46.05,26.55 46.05,25.45 45.95,25.35 45.55,24.95 45.5,24.9 C30.1
  Bottom 0.254: v46.35,24.95 44.15,22.75 42.35,22.75 41.05,21.45 LIPO+.TP | v26.35,30.45 26.85,30.45 28.45,28.85 28.45,27.85 30.85,25.45 33.35,22.95 34.55,22.95 35.05,22.45 v35.05,22.15
  pour Top (no thermals): 39.95,26.05 40.05,26.15 41.35,26.15 41.95,25.55 45.15,25.55 45.15,24.35 39.95,24.35
  pour Top (isolate 0.254, no thermals): 31.75,22.45 45.95,22.45 45.95,15.15 31.75,15.15
MOT1  (via drill 0.5)
  Top 0.25: 23.75,23.75 v24.35,24.35 | v26.15,26.15 26.15,28.45 26.6,28.9
  Top 0.254: 26.6,28.9 29.95,32.25 32.05,32.25 32.85,33.05 32.85,34.45 32.05,35.25 v31.85,35.25 | v34.05,35.95 33.75,36.25 33.75,39.65 v34.05,39.95 | R18.1 23.75,23.75 | U1.15 39.35,47.05 39.35,46.65 v39.65,46.35
  Bottom 0.25: v24.35,24.35 v26.15,26.15
  Bottom 0.254: v31.85,35.25 32.55,35.95 v34.05,35.95 | v34.05,39.95 34.05,40.75 v39.65,46.35
MOT2  (via drill 0.5)
  Top 0.25: U1.16 39.85,47.25 42.55,44.55 42.55,43.55 | v42.75,34.45 43.15,34.85 43.15,42.95 42.85,43.25 | R27.1 v53.35,24.35 | v53.35,24.35
  Top 0.254: 42.55,43.55 42.85,43.25 | v51.45,26.15 51.45,31.25 50.55,32.15 48.75,32.15 v48.35,32.55
  Bottom 0.25: v42.75,34.45 45.55,34.45 45.75,34.25 | v53.35,24.35 51.65,26.05 51.55,26.15 v51.45,26.15
  Bottom 0.254: v48.35,32.55 47.45,32.55 45.75,34.25
MOT3
  Top 0.254: U1.31 39.35,55.55 40.65,56.85 44.75,56.85 45.05,56.85 47.75,54.15 48.05,53.85 51.15,53.85 53.95,56.65 54.75,56.65 54.85,56.65 R25.1
MOT4  (via drill 0.5)
  Top 0.254: v33.95,55.65 31.75,55.65 29.95,53.85 23.85,53.85 R26.1 | v38.85,56.15 U1.32
  Bottom 0.254: v38.85,56.15 38.35,55.65 v33.95,55.65
MOT+
  Top 0.254: R12.2 25.85,48.45 24.35,48.45 | Q2.P$1 Q2.P$2 38.14,23.35 Q2.P$8 39.05,23.05 Q2.P$5 Q2.P$6 39.92,23.45 45.65,23.45
  Top 1.27: U$6.2 10.55,11.15 10.55,12.05 12.35,13.85 15.75,13.85 16.15,13.85 23.85,21.55 25.98,23.68 | U$8.2 67.47,66.24 67.47,66.17 67.47,65.17 63.65,61.35 53.35,51.05 53.35,47.85 55.55,45.65 55.55,41.65 56.45,40.75 56.45,36.95 55.55,36.05 55.55,32.05 53.35,29.85 53.35,28.55 53.35,26.65 53.35,26.15 51.75,24.55 51.55,24.35 48.75,24.35 | 25.65,24.85 26.15,24.35 26.45,24.35 29.85,24.35 30.75,23.45 45.65,23.45 46.95,23.45 47.35,23.85 47.85,24.35 48.75,24.35 | 25.65,24.85 24.75,25.75 24.35,26.15 24.35,29.75 24.35,29.95 18.95,35.35 17.45,36.85 17.45,40.85 24.35,47.75 24.35,48.45 24.35,50.05 | 24.35,50.05 24.35,50.25 | U$9.2 9.95,65.95 9.95,65.45 24.35,51.05 24.35,50.25 | 24.35,50.25 24.35,50.05 | 24.35,50.05 24.35,50.25 | 25.98,23.68 26.55,24.25 | 25.65,24.85 25.98,24.53 25.98,23.68 | 48.75,24.35 50.25,24.35 51.05,24.35 61.85,13.55 65.95,13.55 67.15,12.35 67.15,11.15 U$7.2
MOT_GND  (via drill 0.5, 1)
  Top 0.254: T1.2 40.35,17.95 41.05,18.65 v41.05,19.25
  Top 1.27: U$8.1 64.15,65.64 v64.15,64.55 | U$6.1 13.64,12.15 v14.25,12.15 | 8.65,67.13 v8.65,66.95 | v68.95,10.85 68.95,10.48 U$7.1
  Bottom 0.254: R32.2 38.85,18.15 38.95,18.05 | v41.05,19.25 41.05,18.35 40.75,18.05
  Bottom 1.27: v64.15,64.55 64.15,61.85 60.35,58.05 53.35,51.05 53.35,47.85 58.25,42.95 58.25,34.75 49.85,26.35 | 49.85,26.35 46.95,23.45 44.8,21.3 | v14.25,12.15 14.45,12.15 23.35,21.05 28.25,25.95 28.25,26.05 28,26.3 | v8.65,66.95 8.65,66.75 15.45,59.95 24.35,51.05 24.35,47.75 17.45,40.85 17.45,36.85 28,26.3 | 50.05,25.35 59.25,16.15 63.35,16.15 63.75,16.15 68.95,10.95 v68.95,10.85 | 50.05,25.35 49.85,25.55 | 49.85,25.55 49.85,26.35 | 50.05,25.35 49.85,25.55 | 49.85,25.55 49.15,25.55 | 44.8,21.3 42.45,18.95 | 42.45,18.95 41.7,18.2 41.55,18.05 40.75,18.05 38.95,18.05 36.25,18.05 28,26.3 | 44.8,21.3 44.75,21.35 LIPO-.TP 43.95,20.45 42.45,18.95
MT_PAD1
  pour Top (isolate 0.254, no thermals): 56.45,35.65 56.45,31.65 59.65,34.75 60.15,36.55 57.35,36.55
MT_PAD2
  pour Top (isolate 0.254, no thermals): 56.45,42.05 56.45,46.05 59.65,42.95 60.15,41.15 57.35,41.15
N$1
  Top 0.254: R19.2 53.65,33.5 LED2.C
N$2
  Top 0.305: U1.2 35.55,52.45 34.75,53.25 34.75,54.15 34.15,54.75 U$1.3
N$3
  Top 0.254: R2.1 44.65,31 U$2.5
N$4
  Top 0.254: U$3.8 36.4,39.6 35.75,40.25 35.15,40.85 R5.2
N$5
  Top 0.305: U$3.20 42.25,38.1 C15.1
N$6
  Top 0.254: 35.35,38.6 35.15,38.6 C14.1
  Top 0.305: U$3.10 35.35,38.6
N$7
  Bottom 0.254: R22.2 31.65,48.4 31.65,46.66 U$5.P$1
N$8
  Top 0.254: 51.5,52.94 LED3.A
  Top 0.406: 51.5,52.94 R15.1
N$9
  Top 0.254: LED4.A 53.45,53.01 51.29,50.85 R16.1
N$10
  Top 0.254: R20.2 R17.2 40.3,59.44 BOOTMD.2
N$11
  Top 0.254: U$4.11 51.08,45.08 51.25,45.25 51.25,47.15 50.45,47.95 49.65,48.75 R14.1
N$12
  Top 0.254: U$4.5 47.48,41.78 47.18,41.48 47.05,41.35 45.35,41.35 44.75,40.75 44.75,37.45 45.05,37.15 46.15,36.05 46.45,35.75 47.55,35.75 48.45,35.75 49,35.2 R19.1
N$13
  Top 0.254: U$3.23 41.5,39.6 42.35,40.45 42.35,43.05 42.15,43.25 40.2,43.25 R4.2
N$14
  Top 0.254: R14.2 51.25,48.75 51.25,48.55 51.95,47.85 53.35,46.45 53.95,45.85 LED1.C
N$15
  Bottom 0.254: U$5.P$2 34.31,45.69 34.3,45.7 R23.2
N$16
  Top 0.254: R11.2 48.48,40.43 48.78,40.73 U$4.7
N$17
  Top 0.254: R13.2 45.65,40.35 45.85,40.55 46.05,40.75 47.45,40.75 47.83,41.13 48.13,41.43 U$4.6
N$18
  Top 0.254: U$3.9 36.3,39.1 36.2,39.1 34.25,41.05 34.25,43.05 34.45,43.25 35.75,43.25 36.6,42.4 R3.2
N$19
  Top 0.254: U$3.24 41.3,40.1 41.75,40.55 41.75,42.15 41.5,42.4 R1.2
N$20
  Top 0.254: U$4.15 48.13,47.63 48.35,47.85 48.45,47.95 48.45,50.15 48.45,50.65 48.3,50.8 48.25,50.85 R9.1
N$21
  Top 0.254: U$4.2 45.93,45.08 45.65,45.35 45.65,46.75 46.15,47.25 46.85,47.25 47.55,47.95 47.6,48 R10.1
N$22
  Top 0.25: R18.2 14.85,14.85 11.95,14.85 9.05,11.95
  Top 0.254: U$6.3 9.05,10.18 9.05,11.95
N$23  (via drill 0.5)
  Top 0.254: v32.05,34.15 32.05,33.55 32.05,33.35 31.45,32.75 30.25,32.75 29.85,32.75 26.75,29.65 26,29.65 25.8,29.85 21,34.65 21,40.2 20.75,40.45 20.51,40.69 20.51,41.39 ON/OFF.3 20.45,41.6 20.45,41.95 20.75,42.25 21.15,42.25 22.9,42.25 R7.2 24.06,42.9 | v34.15,33.05 34.2,33 R6.1 | 35.5,33.15 D3.2
  Top 0.3: 35.5,33.15 35.4,33.15 R6.1
  Bottom 0.254: v32.05,34.15 32.35,33.85 33.45,33.85 34.15,33.15 v34.15,33.05
N$24
  pour Top (no thermals): 38.05,28.05 39.25,28.05 39.75,28.55 39.75,29.25 40.65,29.25 40.65,27.75 38.05,27.75
N$25
  Top 0.305: U1.3 35.35,51.95 34.95,52.35 U$1.1
N$26
  Bottom 0.254: R30.1 32.81,31.46 U$5.P$34
N$27
  Top 0.254: 37.9,21.1 37.22,20.42 37.18,20.42 R24.1
  Top 0.406: Q2.P$3 37.84,21.17 37.9,21.1 T1.3
N$28
  pour Top (rank 2, no thermals): 38.05,27.45 40.65,27.45 40.65,26.55 38.55,26.55 38.05,27.05
N$29
  Top 0.254: R31.2 36.65,17.95 T1.1
N$39  (via drill 0.5)
  Top 0.254: U$7.3 64.06,11.35 v63.65,11.75 | R27.2 62.45,15.25 v62.45,14.85
  Bottom 0.254: v63.65,11.75 63.65,13.25 | 63.65,13.25 63.65,13.65 | v62.45,14.85 63.65,13.65 | 63.65,13.65 63.65,13.25
N$40  (via drill 0.5)
  Top 0.254: 68.55,67.55 v68.55,67.45 68.55,67.55 | 68.55,67.55 68.1,68 | 68.1,68 67.35,68.76 U$8.3 | R25.2 62.35,62.35 62.35,64.75 v62.65,65.05 | 68.55,67.55 68.1,68
  Bottom 0.254: v62.65,65.05 63.25,65.65 64.15,65.65 66.75,65.65 v68.55,67.45
N$41
  Top 0.25: R26.2 14.55,63.15 14.55,66.05 14.25,66.35
  Top 0.254: 14.25,66.35 13.55,67.05
  Top 0.406: 13.55,67.05 13.53,67.05 U$9.3
N$43  (via drill 0.5)
  Top 0.254: 45.15,29 U$2.1 45.2,28.4 v45.85,27.75 | v47.25,26.35 47.45,26.15 R29.2
  Bottom 0.254: v45.85,27.75 47.05,26.55 47.15,26.45 v47.25,26.35
N$44
  Top 0.254: LED5.C 50.65,26.7 R29.1
N$45
  pour Top (rank 2, no thermals): 34.15,28.05 36.05,28.05 37.75,26.35 37.75,24.65 37.65,24.55 36.45,24.55 36.35,24.65 36.35,26.55 35.05,27.65 34.15,27.65
  pour Top (no thermals): 39.25,26.25 37.85,26.25 37.75,26.35 37.75,24.65 37.65,24.55 38.15,24.55 38.25,24.45 39.25,24.45 39.35,24.55 39.35,26.15
N$46
  Top 0.406: C13.1 33.05,28.15 33.35,28.45 33.34,28.44 33.34,28.41
  Top 0.61: 33.34,28.41 L1.2
  pour Top (no thermals): 32.35,28.75 33.75,28.75 33.85,28.65 35.05,28.65 35.05,28.35 33.75,28.35 33.75,27.55 32.35,27.55
PWR_OFF  (via drill 0.5)
  Top 0.25: U1.8 35.65,49.45 35.05,48.85 35.05,48.05
  Top 0.254: v36.35,34.65 36.3,34.7 R6.2 34.2,34.7 33.25,35.65 33.25,46.25 35.05,48.05
  Bottom 0.254: R30.2 36.35,33.3 v36.35,34.65
PWR_ON
  Top 0.254: IC1.7 37.73,28.48 37.55,28.65 37.55,30.55 37.85,30.85 | 37.85,30.85 D3.3 | 37.85,30.85 38.05,30.65 R8.2
PWR_ON_µC
  Top 0.25: R28.2 43.55,34.15 42.55,33.15 D3.1
  Top 0.254: U1.17 40.35,47.55 43.25,44.65
  Top 0.3: 43.25,44.65 43.3,44.65 R28.2
RESET1
  Top 0.254: U1.4 35.15,51.45 34.95,51.65 31.85,51.65 30.15,53.35 29.25,53.35 28.6,52.7 C9.2
SPI1_CS
  Top 0.254: R5.1 35.15,44.15 35.25,44.15 35.75,44.65 37.35,46.25 U1.11
SPI1_MISO
  Top 0.254: U1.13 38.35,45.95 38.35,45.2 R3.1
SPI1_MOSI
  Top 0.254: 41.45,44.35 40.75,45.05 39.85,45.05 39.15,45.75 38.85,46.05 U1.14
  Top 0.406: R1.1 41.45,44.35
SPI1_SCK
  Top 0.254: 39.1,44.1 38.25,43.25 36.55,43.25 36.25,43.55 36.25,44.55 37.85,46.15 U1.12
  Top 0.406: R4.1 39.1,44.1
SWCLK  (via drill 0.5)
  Top 0.254: U1.28 40.85,54.05 41.15,54.35 v41.55,54.35
  Bottom 0.254: v41.55,54.35 SWCLK.PP
SWDIO  (via drill 0.5)
  Top 0.254: v44.95,53.15 45.35,52.75 45.35,51.85 44.85,51.35 42.85,51.35 42.25,51.95 U1.25
  Bottom 0.254: SWDIO.PP 44.95,53.75 v44.95,53.15
USART1_RX
  Top 0.254: U1.22 45.5,50.45 45.55,50.45 45.9,50.8 R9.2
USART1_TX
  Top 0.254: U1.21 45,49.95 45.05,49.95 45.8,49.2 45.8,48.85 R10.2
USART2_RX  (via drill 0.5)
  Top 0.254: U1.10 36.85,47.35 v36.55,47.05
  Bottom 0.254: R22.1 34.3,49.25 34.55,49.25 36.15,47.65 36.55,47.25 v36.55,47.05
USART2_TX  (via drill 0.5)
  Top 0.25: 35.75,48.95 35.55,48.75 35.55,47.85
  Top 0.254: U1.9 35.75,48.95 | v35.75,46.25 35.55,46.45 35.55,47.85
  Bottom 0.254: v35.75,46.25 35.75,47.45 34.85,48.35 33.95,48.35 33.7,48.35 R23.1
VBUS  (via drill 0.6)
  Top 0.254: LED5.A 50.65,31.05 50.15,31.55 49.35,31.55 U$2.4 | U$2.4
  Top 0.4: X2.VBUS 53.85,37.55 v53.55,37.25 52.05,35.75 50.65,34.35 48.95,34.35 48.35,33.75 47.75,33.15 C6.2 | C6.2 47.05,33.15 C6.2
  Top 0.406: U$4.10 51.93,44.43 | 51.93,44.43 C16.1 v52.35,46.35 52.35,44.85 51.93,44.43
  Top 0.61: U$2.4 C6.2
  Bottom 0.4: 54.85,37.25 v53.55,37.25
  Bottom 0.406: 54.85,37.25 56.75,37.25 57.05,37.55 57.05,42.75 55.85,43.95 54.65,45.15 53.45,46.35 v52.35,46.35
VCC  (via drill 0.5)
  Top 0.254: 43.9,48.9 43.75,48.9 C3.1 | R31.1 33.95,20.65 v33.95,22.15
  Top 0.305: U1.1 36.08,54.78 C7.1 | C11.1 35.2,50.45 U1.6 | U1.19 43.2,48.95 | 35.2,57.65 35.2,57.75 35.2,58.7 36.75,60.25 BOOTMD.1 | U$3.13 37.6,35.75 C1.1 | U1.27 42.6,52.95 C5.1 43.8,54.15
  Top 0.4: 30.05,49.15 31.7,49.15 | 37.75,32.05 37.95,32.05 37.75,32.25 37.55,32.05 | 37.75,32.05 37.55,32.05 | 37.55,32.05 37.05,32.05 36.65,31.65 33.55,31.65 | 33.55,31.65 33.35,31.65 33.35,31.85 | 29.75,49.15 29.75,49.45 | 29.75,49.45 29.75,52.45 v29.85,52.55 | 29.75,49.45 30.05,49.15 | 30.05,49.15 29.75,48.85 29.75,47.55 30.45,46.85 31.85,46.85 32.65,46.05 32.65,35.55 33.35,34.85 33.35,31.95 | 37.75,35.1 37.75,32.45 37.75,32.05 | 45.15,47.85 46.55,47.85 46.75,48.05 46.75,52.65 45.25,54.15 43.8,54.15 | 43.9,49.1 44.95,48.05 44.95,47.65 44.65,47.35 44.65,43.63 44.15,43.13 44.15,42.36 | v44.85,42.36 44.15,42.36 | 33.35,31.95 33.35,31.85 | 33.55,31.65 33.35,31.85 | 33.35,31.95 33.15,31.75 | 44.12,33.89 43.37,33.14 | 43.37,33.14 42.28,32.05 37.55,32.05 | 44.15,42.36 44.15,33.92 43.37,33.14
  Top 0.406: C7.1 35.2,57.65 | C11.1 C10.1 31.7,49.15 | 30.05,49.15 29.75,49.15 29.75,48.85 | v33.75,57.55 34.8,57.55 C2.1 35.2,57.75 | C1.1 37.75,35.1 | 44.95,47.65 45.15,47.85 44.95,48.05 | C3.1 43.9,49.1 | v44.85,42.35 v44.85,42.36 | 43.9,48.9 43.25,48.9 43.2,48.95
  Top 0.61: 33.35,31.65 30.35,31.65 29.65,30.95 27.55,28.85 v27.55,28.55 27.95,28.15 | 27.95,28.15 28.1,28 C33.2 28.6,28.15 27.95,28.15
  Bottom 0.254: v27.55,28.55 27.55,28.05 33.4,22.2 33.45,22.15 v33.95,22.15
  Bottom 0.4: 45.15,46.55 45.95,47.35 46,47.4 C21.1 | 44.85,46.25 v44.85,42.35 | U$5.P$11 48.55,46.24 C21.1 | U$5.P$12 48.55,46.26 C21.1
  Bottom 0.406: v33.75,57.55 33.55,57.55 29.85,53.85 v29.85,52.55 | 45.15,46.55 44.85,46.25
  pour Top (no thermals): 28.25,27.45 31.65,27.45 31.65,28.85 32.05,29.25 32.05,30.85 30.65,30.85 28.25,28.45
VCCIO  (via drill 0.5)
  Top 0.254: 50.1,41.15 C19.1 | U$4.1 46.55,45.78 46.55,46.35 v46.45,46.45 | U$4.9 50.95,43.78 v50.95,42.35 50.95,41.75 50.75,41.55 | 50.75,41.55 50.65,41.45 50.6,41.4 50.75,41.25 | 50.75,41.55 50.75,41.35 50.75,41.25 | LED1.A 53.25,41.7 53.25,40.95 52.75,40.45 51.95,40.45 51.75,40.45 | 50.75,41.25 51.55,40.45 | 51.55,40.45 51.75,40.45 | 51.55,40.45 51.55,40.35 | 51.55,40.35 51.55,40.05 51.75,39.85 51.95,39.65 v51.95,39.05 | 51.75,40.45 51.65,40.45 51.55,40.35 | v52.95,35.35 53.05,35.45 53.85,35.45
  Top 0.4: 53.85,35.45 53.85,35.4 LED2.A
  Top 0.406: U$4.8 49.43,41.83 C19.1 50.6,41.4
  Bottom 0.254: v46.45,46.45 46.05,46.05 46.05,43.95 47.65,42.35 49.95,42.35 v50.95,42.35 | v52.95,35.35 51.95,36.35 v51.95,39.05
VOLTAGE  (via drill 0.5)
  Top 0.25: U1.7 35.45,49.95 34.65,49.15 34.65,48.35 34.35,48.05 34.05,48.05 31.05,48.05 v30.75,47.75
  Top 0.254: R21.2 R12.1 v28.6,47.35 C20.1
  Bottom 0.254: v28.6,47.35 30.35,47.35 v30.75,47.75

### Text on the board
tNames: RX | TX